# Altium project LM5145_Buck_Converter.PrjPcb
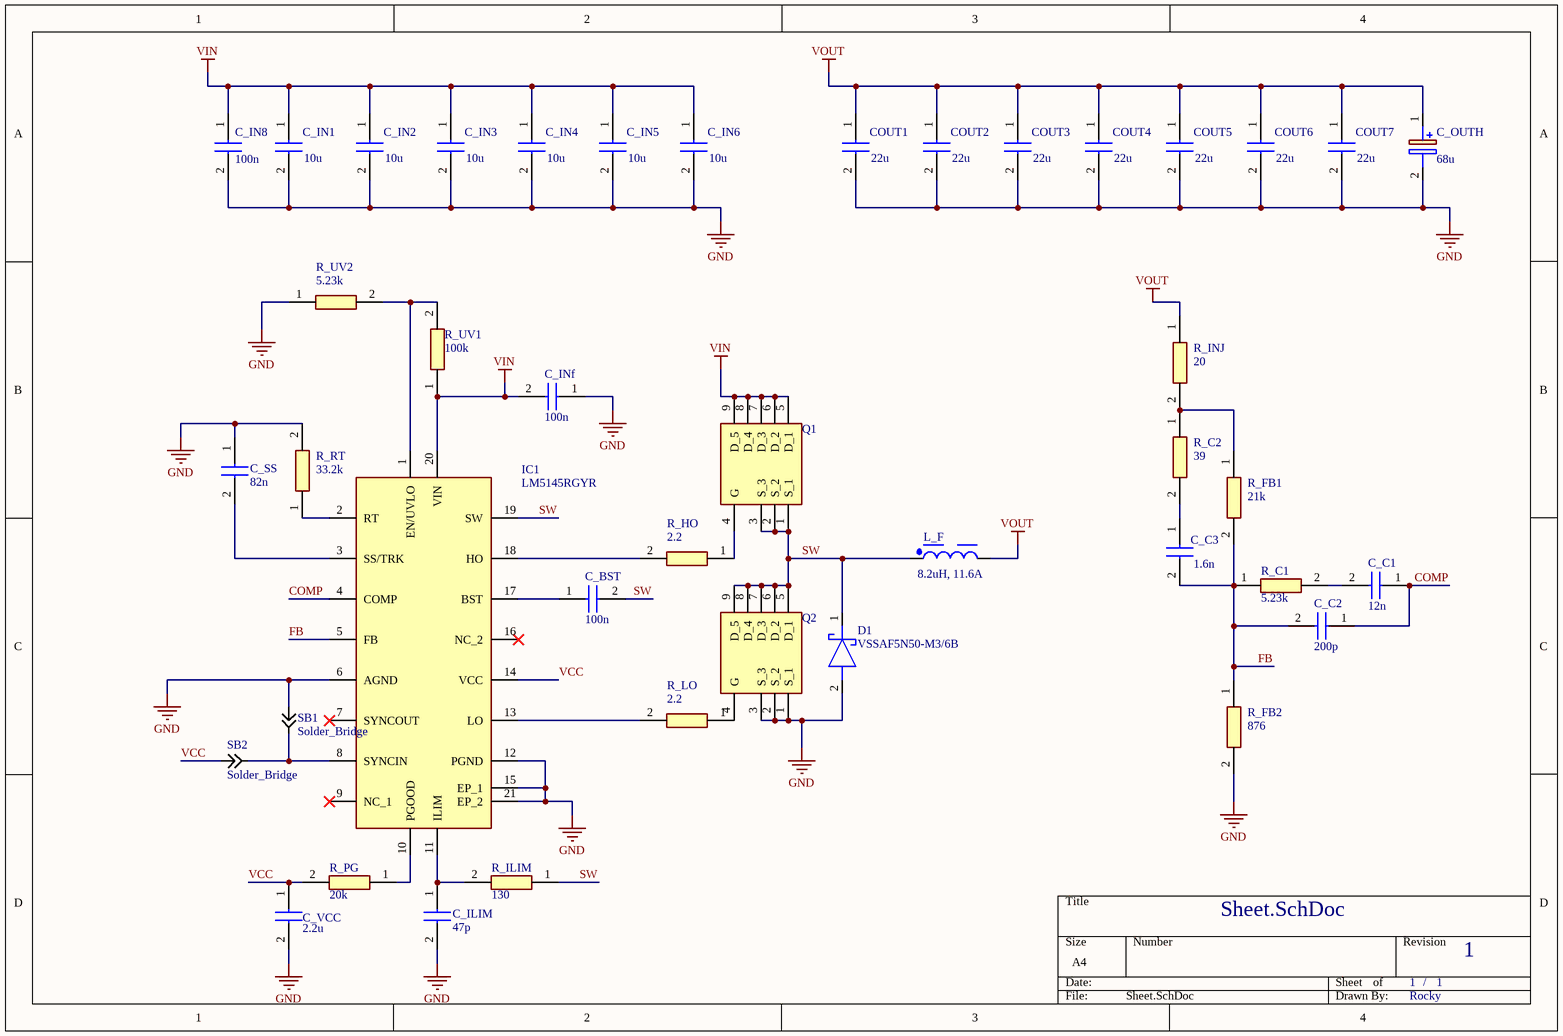
[diagram p0: Sheet.SchDoc]
Author: Rocky; Revision: 1
1 sheet, 42 parts. Net scope: global (net labels, ports and power ports of the same name join across sheets).
Board file: PCB.PcbDoc

## Sheet Sheet.SchDoc
size A4; SheetNumber: 1; SheetTotal: 1

### Parts
C_BST  100n  [CAPC1608X90N]
C_C1  12n  [CAPC1608X90N]
C_C2  200p  [CAPC1608X90N]
C_C3  1.6n  [CAPC1608X90N]
C_ILIM  47p  [CAPC1608X90N]
C_IN1  10u  [CAPC6153X390N]
C_IN2  10u  [CAPC6153X390N]
C_IN3  10u  [CAPC6153X390N]
C_IN4  10u  [CAPC6153X390N]
C_IN5  10u  [CAPC6153X390N]
C_IN6  10u  [CAPC6153X390N]
C_IN8  100n  [CAPC1608X90N]
C_INf  100n  [CAPC1608X90N]
C_OUTH  68u  [35TQS68ME2]
C_SS  82n  [CAPC1608X90N]
C_VCC  2.2u  [CAPC1608X90N]
COUT1  22u  [CAPC6153X390N]
COUT2  22u  [CAPC6153X390N]
COUT3  22u  [CAPC6153X390N]
COUT4  22u  [CAPC6153X390N]
COUT5  22u  [CAPC6153X390N]
COUT6  22u  [CAPC6153X390N]
COUT7  22u  [CAPC6153X390N]
D1  VSSAF5N50-M3/6B  [SODFL5226X100N]
IC1  LM5145RGYR  [RGY0020B]
L_F  8.2uH, 11.6A  [WE-LHCA_1365]
Q1  AON6512  [AON6414A]  (value not drawn)
Q2  AON6512  [AON6414A]  (value not drawn)
R_C1  5.23k  [RESC1608X55N]
R_C2  39  [RESC1608X55N]
R_FB1  21k  [RESC1608X55N]
R_FB2  876  [RESC1608X55N]
R_HO  2.2  [RESC1608X55N]
R_ILIM  130  [RESC1608X55N]
R_INJ  20  [RESC1608X55N]
R_LO  2.2  [RESC1608X55N]
R_PG  20k  [RESC1608X55N]
R_RT  33.2k  [RESC1608X55N]
R_UV1  100k  [RESC1608X55N]
R_UV2  5.23k  [RESC1608X55N]
SB1  Solder_Bridge  [Solderbridge]
SB2  Solder_Bridge  [Solderbridge]

### Nets
GND: C_ILIM.2 C_IN1.2 C_IN2.2 C_IN3.2 C_IN4.2 C_IN5.2 C_IN6.2 C_IN8.2 C_INf.1 C_OUTH.2(-) C_SS.1 C_VCC.2 COUT1.2 COUT2.2 COUT3.2 COUT4.2 COUT5.2 COUT6.2 COUT7.2 D1.2(A) IC1.6(AGND) IC1.12(PGND) IC1.15(EP_1) IC1.21(EP_2) Q2.1(S_1) Q2.2(S_2) Q2.3(S_3) R_FB2.2 R_RT.2 R_UV2.1 SB1.1
VIN: C_IN1.1 C_IN2.1 C_IN3.1 C_IN4.1 C_IN5.1 C_IN6.1 C_IN8.1 C_INf.2 IC1.20(VIN) Q1.5(D_1) Q1.6(D_2) Q1.7(D_3) Q1.8(D_4) Q1.9(D_5) R_UV1.1
VOUT: C_OUTH.1(+) COUT1.1 COUT2.1 COUT3.1 COUT4.1 COUT5.1 COUT6.1 COUT7.1 L_F.2 R_INJ.1
COMP: C_C1.1 C_C2.1 IC1.4(COMP)
FB: C_C2.2 C_C3.2 IC1.5(FB) R_C1.1 R_FB1.2 R_FB2.1
SW: C_BST.2 D1.1(K) IC1.19(SW) L_F.1 Q1.1(S_1) Q1.2(S_2) Q1.3(S_3) Q2.5(D_1) Q2.6(D_2) Q2.7(D_3) Q2.8(D_4) Q2.9(D_5) R_ILIM.1
VCC: C_VCC.1 IC1.14(VCC) R_PG.2 SB2.1
NetC_BST_1: C_BST.1 IC1.17(BST)
NetC_C1_2: C_C1.2 R_C1.2
NetC_C3_1: C_C3.1 R_C2.2
NetC_ILIM_1: C_ILIM.1 IC1.11(ILIM) R_ILIM.2
NetC_SS_2: C_SS.2 IC1.3(SS/TRK)
NetIC1_1: IC1.1(EN/UVLO) R_UV1.2 R_UV2.2
NetIC1_2: IC1.2(RT) R_RT.1
NetIC1_8: IC1.8(SYNCIN) SB1.2 SB2.2
NetIC1_10: IC1.10(PGOOD) R_PG.1
NetIC1_13: IC1.13(LO) R_LO.2
NetIC1_18: IC1.18(HO) R_HO.2
NetQ1_4: Q1.4(G) R_HO.1
NetQ2_4: Q2.4(G) R_LO.1
NetR_C2_1: R_C2.1 R_FB1.1 R_INJ.2

Not connected (* = marked no-connect by the designer): IC1 7(SYNCOUT)* 9(NC_1)* 16(NC_2)*

### Notes on the sheet
- /

### Library data of the parts
C_BST C_IN8 C_INf C_SS = GRM1885C1H101JA01D: Capacitor; Manufacturer_Name: Murata Electronics; Datasheet Link: https://search.murata.co.jp/Ceramy/image/img/A01X/G101/ENG/GRM1885C1H101JA01-01A.pdf; Height: 0.9mm; Manufacturer_Part_Number: GRM1885C1H101JA01D; Mouser Part Number: 81-GRM39C101J50; Mouser Price/Stock: https://www.mouser.co.uk/ProductDetail/Murata-Electronics/GRM1885C1H101JA01D?qs=H3lwsW1hsDt1I4guwPQ00A%3D%3D; Arrow Part Number: GRM1885C1H101JA01D; Arrow Price/Stock: https://www.arrow.com/en/products/grm1885c1h101ja01d/murata-manufacturing?utm_currency=USD&region=europe
C_C1-C_C3 C_ILIM C_VCC = 06031A470JAT2A: Capacitor; Manufacturer_Name: Kyocera AVX; Datasheet Link: https://componentsearchengine.com/Datasheets/1/06031A100FAT2A.pdf; Height: 0.9mm; Manufacturer_Part_Number: 06031A470JAT2A; Mouser Part Number: 581-06031A470J; Mouser Price/Stock: https://www.mouser.co.uk/ProductDetail/AVX/06031A470JAT2A?qs=nNiE93Mz5OcjglFzY7DsjQ%3D%3D; Arrow Part Number: 06031A470JAT2A; Arrow Price/Stock: https://www.arrow.com/en/products/06031a470jat2a/avx
C_IN1-C_IN6 = KRM55QR71J106KH01K: Capacitor / KRM55QR71J106KH01K; Manufacturer_Name: Murata Electronics; Datasheet Link: https://search.murata.co.jp/Ceramy/image/img/A01X/G101/ENG/KRM55_25V-100V_E.pdf; Height: 3.9mm; Manufacturer_Part_Number: KRM55QR71J106KH01K; Mouser Part Number: 81-KRM55QR71J106KH1K; Mouser Price/Stock: https://www.mouser.co.uk/ProductDetail/Murata-Electronics/KRM55QR71J106KH01K?qs=TpyF2b7C1Q%252BAGaaMhvrt1g%3D%3D; Arrow Part Number: KRM55QR71J106KH01K; Arrow Price/Stock: https://www.arrow.com/en/products/krm55qr71j106kh01k/murata-manufacturing
C_OUTH = 35TQS68ME2: Capacitor Polarised; Manufacturer_Name: Panasonic; Datasheet Link: https://industrial.panasonic.com/cdbs/www-data/pdf/AAA8000/AAA8000C80.pdf; Height: 2mm; Manufacturer_Part_Number: 35TQS68ME2; Simulation Data: https://industrial.panasonic.com/content/data/CP/files/35TQS68ME2.zip
COUT1-COUT7 = KCM55QR71H226KH13K: Capacitor / KCM55QR71H226KH13K; Manufacturer_Name: Murata Electronics; Datasheet Link: https://search.murata.co.jp/Ceramy/image/img/A01X/G101/ENG/KCM55_E.pdf; Height: 3.9mm; Manufacturer_Part_Number: KCM55QR71H226KH13K; Mouser Part Number: 81-KCM5QR71H226KH13K; Mouser Price/Stock: https://www.mouser.co.uk/ProductDetail/Murata-Electronics/KCM55QR71H226KH13K?qs=By6Nw2ByBD05%2F38SiX9q2w%3D%3D; Arrow Part Number: KCM55QR71H226KH13K; Arrow Price/Stock: https://www.arrow.com/en/products/kcm55qr71h226kh13k/murata-manufacturing?region=nac
D1 = VSSAF3M10-M3_H: Schottky Diode; Manufacturer_Name: Vishay; Manufacturer_Part_Number: VSSAF3M10-M3/H; Datasheet Link: https://www.vishay.com/docs/87507/vssaf3m10.pdf; Height: 1mm; Mouser Part Number: 78-VSSAF3M10-M3/H; Mouser Price/Stock: https://www.mouser.co.uk/ProductDetail/Vishay-General-Semiconductor/VSSAF3M10-M3-H?qs=ECv811tYSNjzBSZPydhz4A%3D%3D; Arrow Part Number: VSSAF3M10-M3/H; Arrow Price/Stock: https://www.arrow.com/en/products/vssaf3m10-m3h/vishay
IC1 = LM5145RGYR: Integrated Circuit; Manufacturer_Name: Texas Instruments; Datasheet Link: http://www.ti.com/lit/ds/symlink/lm5145.pdf?HQS=TI-null-null-mousermode-df-pf-null-wwe&DCM=yes&ref_url=https%3A%2F%2Fwww.mouser.com%2F; Manufacturer_Part_Number: LM5145RGYR; Mouser Part Number: 595-LM5145RGYR; Mouser Price/Stock: https://www.mouser.co.uk/ProductDetail/Texas-Instruments/LM5145RGYR?qs=gt1LBUVyoHkKVoSLabi7ZQ%3D%3D; Arrow Part Number: LM5145RGYR; Arrow Price/Stock: https://www.arrow.com/en/products/lm5145rgyr/texas-instruments?region=nac
L_F = 784373865082: WE-LHCA Low Profile High Current Inductor, SMT, size 1365, 8.2uH, 11.6A; Manufacturer: Wurth Elektronik; Case/Size Code: 1365; DC Resistance: 12mOhm; Saturation Current: 20.2A; Manufacturer Part Number: 784373865082; Category: Power Inductors; Match Code: WE-LHCA; ComponentLink1Description: Website Link; ComponentLink1URL: https://www.we-online.com/redexpert/article/784373865082?ad; ComponentLink2Description: Datasheet Link; ComponentLink2URL: https://www.we-online.com/redexpert/spec/784373865082?ad; Mount: Surface Mount; Min Operating Temperature: -55°C; Max Operating Temperature: 155°C; Packaging: Tape and Reel; Length: 13.45mm; Width: 12.6mm; Height: 6.3mm; Inductance: 8.2uH; Performance Rated Current: 11.6A
Q1 Q2 = AON6512: MOSFET (P-Channel); Manufacturer_Name: Alpha & Omega Semiconductors; Datasheet Link: http://aosmd.com/res/data_sheets/AON6512.pdf; Manufacturer_Part_Number: AON6512; Arrow Part Number: AON6512; Arrow Price/Stock: https://www.arrow.com/en/products/aon6512/alpha-and-omega-semiconductor?region=nac
R_C1 R_C2 R_FB1 R_FB2 R_ILIM R_INJ R_PG = ERJ-3EKF1270V: Resistor; Manufacturer_Name: Panasonic; Datasheet Link: http://industrial.panasonic.com/cdbs/www-data/pdf/RDA0000/AOA0000C86.pdf; Height: 0.55mm; Manufacturer_Part_Number: ERJ-3EKF1270V; Mouser Part Number: 667-ERJ-3EKF1270V; Mouser Price/Stock: https://www.mouser.co.uk/ProductDetail/Panasonic/ERJ-3EKF1270V?qs=iBwFsHVUAOcgnyLg6A6PxQ%3D%3D; Arrow Part Number: ERJ-3EKF1270V; Arrow Price/Stock: https://www.arrow.com/en/products/erj3ekf1270v/panasonic
R_HO R_LO R_RT R_UV1 R_UV2 = RC0603FR-105K1L: Resistor; Manufacturer_Name: YAGEO; Datasheet Link: https://www.mouser.com/datasheet/2/447/PYu_RC_Group_51_RoHS_L_11-1984063.pdf; Height: 0.55mm; Manufacturer_Part_Number: RC0603FR-105K1L; Mouser Part Number: 603-RC0603FR-105K1L; Mouser Price/Stock: https://www.mouser.co.uk/ProductDetail/YAGEO/RC0603FR-105K1L?qs=qpJ%252B%252B%252Bdg6p362H%2FoHYJ5dQ%3D%3D; Arrow Part Number: RC0603FR-105K1L; Arrow Price/Stock: https://www.arrow.com/en/products/rc0603fr-105k1l/yageo?utm_currency=USD&region=nac